# Altium project comp9.PrjPcb (part 2 of 2)

## Sheet ethusb.SchDoc
size A
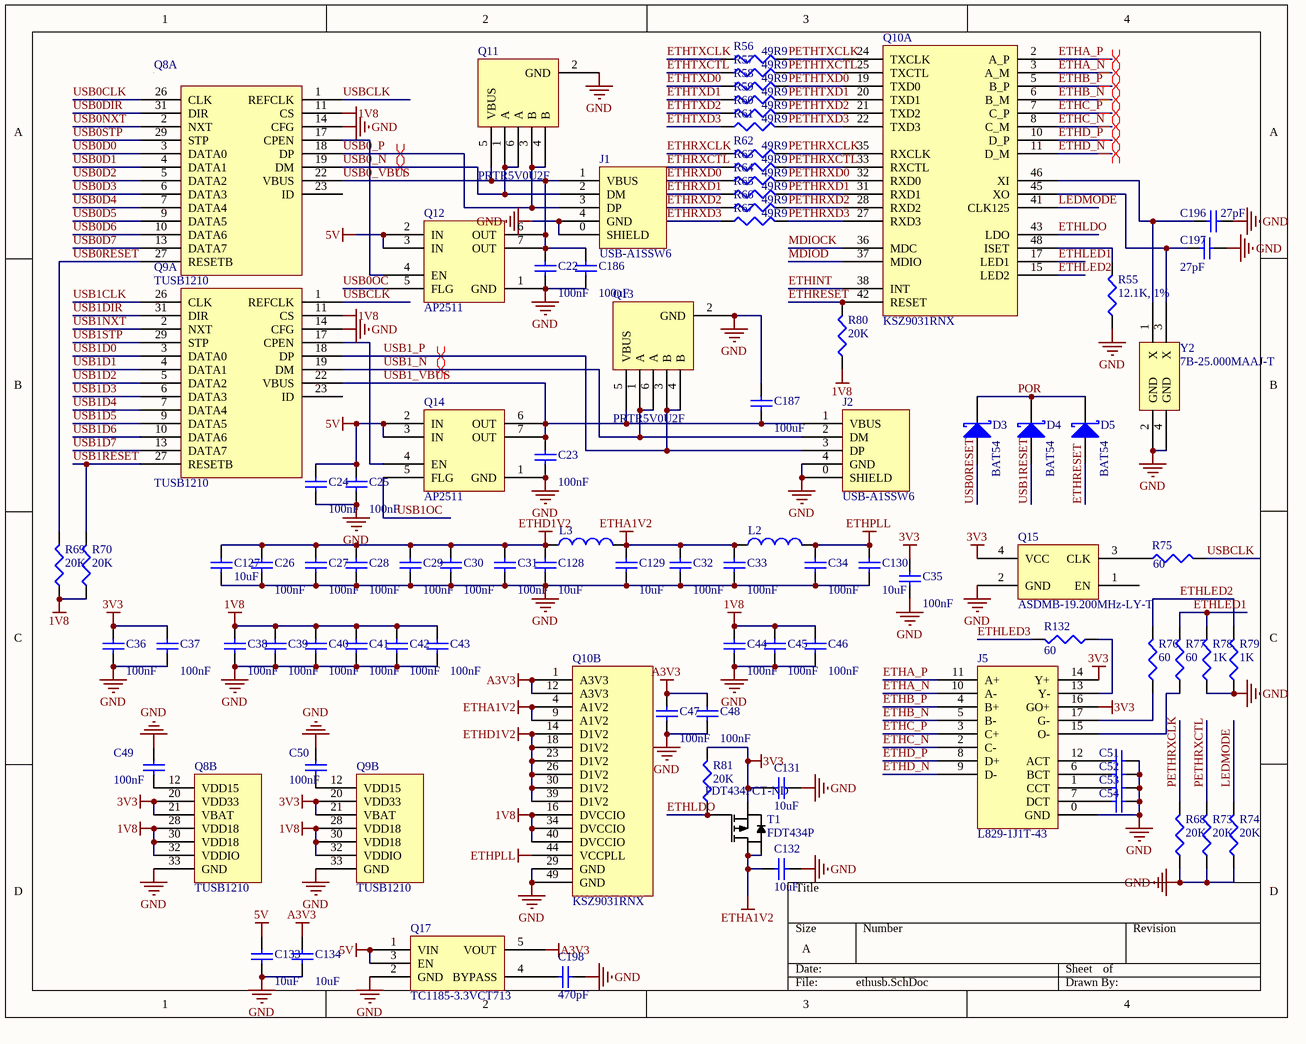
[diagram p4: ethusb.SchDoc]

### Parts
C22  value 100nF  [CAPC1005X06L]  (hidden comment: Cap)
C23  value 100nF  [CAPC1005X06L]  (hidden comment: Cap)
C24  value 100nF  [CAPC1005X06L]  (hidden comment: Cap)
C25  value 100nF  [CAPC1005X06L]  (hidden comment: Cap)
C26  value 100nF  [CAPC1005X06L]  (hidden comment: Cap)
C27  value 100nF  [CAPC1005X06L]  (hidden comment: Cap)
C28  value 100nF  [CAPC1005X06L]  (hidden comment: Cap)
C29  value 100nF  [CAPC1005X06L]  (hidden comment: Cap)
C30  value 100nF  [CAPC1005X06L]  (hidden comment: Cap)
C31  value 100nF  [CAPC1005X06L]  (hidden comment: Cap)
C32  value 100nF  [CAPC1005X06L]  (hidden comment: Cap)
C33  value 100nF  [CAPC1005X06L]  (hidden comment: Cap)
C34  value 100nF  [CAPC1005X06L]  (hidden comment: Cap)
C35  value 100nF  [CAPC1005X06L]  (hidden comment: Cap)
C36  value 100nF  [CAPC1005X06L]  (hidden comment: Cap)
C37  value 100nF  [CAPC1005X06L]  (hidden comment: Cap)
C38  value 100nF  [CAPC1005X06L]  (hidden comment: Cap)
C39  value 100nF  [CAPC1005X06L]  (hidden comment: Cap)
C40  value 100nF  [CAPC1005X06L]  (hidden comment: Cap)
C41  value 100nF  [CAPC1005X06L]  (hidden comment: Cap)
C42  value 100nF  [CAPC1005X06L]  (hidden comment: Cap)
C43  value 100nF  [CAPC1005X06L]  (hidden comment: Cap)
C44  value 100nF  [CAPC1005X06L]  (hidden comment: Cap)
C45  value 100nF  [CAPC1005X06L]  (hidden comment: Cap)
C46  value 100nF  [CAPC1005X06L]  (hidden comment: Cap)
C47  value 100nF  [CAPC1005X06L]  (hidden comment: Cap)
C48  value 100nF  [CAPC1005X06L]  (hidden comment: Cap)
C49  value 100nF  [CAPC1005X06L]  (hidden comment: Cap)
C50  value 100nF  [CAPC1005X06L]  (hidden comment: Cap)
C51  Cap  [CAPC1005X06L]  (value not drawn)
C52  Cap  [CAPC1005X06L]  (value not drawn)
C53  Cap  [CAPC1005X06L]  (value not drawn)
C54  Cap  [CAPC1005X06L]  (value not drawn)
C127  value 10uF  [CAPC1608X90N]  (hidden comment: GRM188R60G106ME47)
C128  value 10uF  [CAPC1608X90N]  (hidden comment: GRM188R60G106ME47)
C129  value 10uF  [CAPC1608X90N]  (hidden comment: GRM188R60G106ME47)
C130  value 10uF  [CAPC1608X90N]  (hidden comment: GRM188R60G106ME47)
C131  value 10uF  [CAPC1608X90N]  (hidden comment: GRM188R60G106ME47)
C132  value 10uF  [CAPC1608X90N]  (hidden comment: GRM188R60G106ME47)
C133  value 10uF  [CAPC1608X90N]  (hidden comment: GRM188R60G106ME47)
C134  value 10uF  [CAPC1608X90N]  (hidden comment: GRM188R60G106ME47)
C186  value 100uF  [CAPC3225X220N]  (hidden comment: GRM31CR60J107ME39L)
C187  value 100uF  [CAPC3225X220N]  (hidden comment: GRM31CR60J107ME39L)
C196  value 27pF  [CAPC1608X90N]  (hidden comment: CL10C270JB8NNNC)
C197  value 27pF  [CAPC1608X90N]  (hidden comment: CL10C270JB8NNNC)
C198  value 470pF  [CAPC1608X90N]  (hidden comment: CL10C471JB8NCNC)
D3  BAT54  [BAT54]
D4  BAT54  [BAT54]
D5  BAT54  [BAT54]
J1  USB-A1SSW6  [USB-A1SSW6]
J2  USB-A1SSW6  [USB-A1SSW6]
J5  L829-1J1T-43  [ETH-L829-1J1T-43]
L2  BLM18SG121TN1  [CAPC1608X90N]  (value not drawn)
L3  BLM18SG121TN1  [CAPC1608X90N]  (value not drawn)
Q8  TUSB1210  [QFN50P500X500X80_HS-33N]  (parts A,B of 2)
Q9  TUSB1210  [QFN50P500X500X80_HS-33N]  (parts A,B of 2)
Q10  KSZ9031RNX  (parts A,B of 2)
Q11  PRTR5V0U2F  [SOT886]
Q12  AP2511  [SOIC127P600X175-8AN]
Q13  PRTR5V0U2F  [SOT886]
Q14  AP2511  [SOIC127P600X175-8AN]
Q15  ASDMB-19.200MHz-LY-T  [ASDMB]
Q17  TC1185-3.3VCT713  [SOT23-5]
R55  value 12.1K, 1%  [J1-0603]  (hidden comment: RC1608F1212CS)
R56  value 49R9  [CAPC1005X06L]  (hidden comment: RC1005F49R9CS)
R57  value 49R9  [CAPC1005X06L]  (hidden comment: RC1005F49R9CS)
R58  value 49R9  [CAPC1005X06L]  (hidden comment: RC1005F49R9CS)
R59  value 49R9  [CAPC1005X06L]  (hidden comment: RC1005F49R9CS)
R60  value 49R9  [CAPC1005X06L]  (hidden comment: RC1005F49R9CS)
R61  value 49R9  [CAPC1005X06L]  (hidden comment: RC1005F49R9CS)
R62  value 49R9  [CAPC1005X06L]  (hidden comment: RC1005F49R9CS)
R63  value 49R9  [CAPC1005X06L]  (hidden comment: RC1005F49R9CS)
R64  value 49R9  [CAPC1005X06L]  (hidden comment: RC1005F49R9CS)
R65  value 49R9  [CAPC1005X06L]  (hidden comment: RC1005F49R9CS)
R66  value 49R9  [CAPC1005X06L]  (hidden comment: RC1005F49R9CS)
R67  value 49R9  [CAPC1005X06L]  (hidden comment: RC1005F49R9CS)
R68  value 20K  [J1-0603]  (hidden comment: RC1608F203CS)
R69  value 20K  [J1-0603]  (hidden comment: RC1608F203CS)
R70  value 20K  [J1-0603]  (hidden comment: RC1608F203CS)
R73  value 20K  [J1-0603]  (hidden comment: RC1608F203CS)
R74  value 20K  [J1-0603]  (hidden comment: RC1608F203CS)
R75  value 60  [J1-0603]  (hidden comment: RC1608F60R4CS)
R76  value 60  [J1-0603]  (hidden comment: RC1608F60R4CS)
R77  value 60  [J1-0603]  (hidden comment: RC1608F60R4CS)
R78  value 1K  [J1-0603]  (hidden comment: RC1608J102CS)
R79  value 1K  [J1-0603]  (hidden comment: RC1608J102CS)
R80  value 20K  [J1-0603]  (hidden comment: RC1608F203CS)
R81  value 20K  [J1-0603]  (hidden comment: RC1608F203CS)
R132  value 60  [J1-0603]  (hidden comment: RC1608F60R4CS)
T1  FDT434P  Supplier Part Number 1: FDT434PCT-ND
Y2  7B-25.000MAAJ-T  [XTAL]

### Nets
1V8: C38.2 C39.2 C40.2 C41.2 C42.2 C43.2 C44.2 C45.2 C46.2 Q8.11(CS) Q8.28(VDD18) Q8.30(VDD18) Q8.32(VDDIO) Q9.11(CS) Q9.28(VDD18) Q9.30(VDD18) Q9.32(VDDIO) Q10.16(DVCCIO) Q10.34(DVCCIO) Q10.40(DVCCIO) R69.1 R70.1 R80.1
3V3: C35.2 C36.2 C37.2 C131.2 J5.14(Y+) J5.16(GO+) Q8.20(VDD33) Q8.21(VBAT) Q9.20(VDD33) Q9.21(VBAT) Q15.4(VCC) R81.2 T1.3(S)
5V: C24.2 C25.2 C133.2 Q12.2(IN) Q12.3(IN) Q14.2(IN) Q14.3(IN) Q17.1(VIN) Q17.3(EN)
A3V3: C47.2 C48.2 C134.2 Q10.1(A3V3) Q10.12(A3V3) Q17.5(VOUT)
ETHA1V2: C32.2 C33.2 C129.2 C132.2 L2.1 L3.2 Q10.4(A1V2) Q10.9(A1V2) T1.2(D) T1.4(D)
ETHD1V2: C26.2 C27.2 C28.2 C29.2 C30.2 C31.2 C127.1 C128.2 L3.1 Q10.14(D1V2) Q10.18(D1V2) Q10.23(D1V2) Q10.26(D1V2) Q10.30(D1V2) Q10.39(D1V2)
ETHPLL: C34.2 C130.2 L2.2 Q10.44(VCCPLL)
GND: C22.1 C23.1 C24.1 C25.1 C26.1 C27.1 C28.1 C29.1 C30.1 C31.1 C32.1 C33.1 C34.1 C35.1 C36.1 C37.1 C38.1 C39.1 C40.1 C41.1 C42.1 C43.1 C44.1 C45.1 C46.1 C47.1 C48.1 C49.2 C50.1 C51.1 C52.1 C53.1 C54.1 C127.2 C128.1 C129.1 C130.1 C131.1 C132.1 C133.1 C134.1 C186.1 C187.2 C196.1 C197.1 C198.1 J1.0(SHIELD) J1.4(GND) J2.0(SHIELD) J2.4(GND) J5.0(GND) Q8.14(CFG) Q8.33(GND) Q9.14(CFG) Q9.33(GND) Q10.29(GND) Q10.49(GND) Q11.2(GND) Q12.1(GND) Q13.2(GND) Q14.1(GND) Q15.2(GND) Q17.2(GND) R55.1 R68.1 R73.1 R74.1 R78.1 R79.1 Y2.2(GND) Y2.4(GND)
ETHA_N: J5.10(A-) Q10.3(A_M)
ETHA_P: J5.11(A+) Q10.2(A_P)
ETHB_N: J5.5(B-) Q10.6(B_M)
ETHB_P: J5.4(B+) Q10.5(B_P)
ETHC_N: J5.2(C-) Q10.8(C_M)
ETHC_P: J5.3(C+) Q10.7(C_P)
ETHD_N: J5.9(D-) Q10.11(D_M)
ETHD_P: J5.8(D+) Q10.10(D_P)
ETHINT: Q10.38(INT)
ETHLDO: Q10.43(LDO) R81.1 T1.1(G)
ETHLED1: Q10.17(LED1) R77.2 R78.2
ETHLED2: Q10.15(LED2) R76.2 R79.2
ETHLED3: R132.2
ETHRESET: D5.1(A) Q10.42(RESET) R80.2
ETHRXCLK: R62.1
ETHRXCTL: R63.1
ETHRXD0: R64.1
ETHRXD1: R65.1
ETHRXD2: R66.1
ETHRXD3: R67.1
ETHTXCLK: R56.1
ETHTXCTL: R57.1
ETHTXD0: R58.1
ETHTXD1: R59.1
ETHTXD2: R60.1
ETHTXD3: R61.1
LEDMODE: Q10.41(CLK125) R74.2
MDIOCK: Q10.36(MDC)
MDIOD: Q10.37(MDIO)
PETHRXCLK: Q10.35(RXCLK) R62.2 R68.2
PETHRXCTL: Q10.33(RXCTL) R63.2 R73.2
PETHRXD0: Q10.32(RXD0) R64.2
PETHRXD1: Q10.31(RXD1) R65.2
PETHRXD2: Q10.28(RXD2) R66.2
PETHRXD3: Q10.27(RXD3) R67.2
PETHTXCLK: Q10.24(TXCLK) R56.2
PETHTXCTL: Q10.25(TXCTL) R57.2
PETHTXD0: Q10.19(TXD0) R58.2
PETHTXD1: Q10.20(TXD1) R59.2
PETHTXD2: Q10.21(TXD2) R60.2
PETHTXD3: Q10.22(TXD3) R61.2
POR: D3.2(K) D4.2(K) D5.2(K)
USB0_N: J1.2(DM) Q8.19(DM) Q11.1(A) Q11.6(A)
USB0_P: J1.3(DP) Q8.18(DP) Q11.3(B) Q11.4(B)
USB0_VBUS: C22.2 C186.2 J1.1(VBUS) Q8.22(VBUS) Q11.5(VBUS) Q12.6(OUT) Q12.7(OUT)
USB0CLK: Q8.26(CLK)
USB0D0: Q8.3(DATA0)
USB0D1: Q8.4(DATA1)
USB0D2: Q8.5(DATA2)
USB0D3: Q8.6(DATA3)
USB0D4: Q8.7(DATA4)
USB0D5: Q8.9(DATA5)
USB0D6: Q8.10(DATA6)
USB0D7: Q8.13(DATA7)
USB0DIR: Q8.31(DIR)
USB0NXT: Q8.2(NXT)
USB0OC: Q12.5(FLG)
USB0RESET: D3.1(A) Q8.27(RESETB) R69.2
USB0STP: Q8.29(STP)
USB1_N: J2.2(DM) Q9.19(DM) Q13.1(A) Q13.6(A)
USB1_P: J2.3(DP) Q9.18(DP) Q13.3(B) Q13.4(B)
USB1_VBUS: C23.2 C187.1 J2.1(VBUS) Q9.22(VBUS) Q13.5(VBUS) Q14.6(OUT) Q14.7(OUT)
USB1CLK: Q9.26(CLK)
USB1D0: Q9.3(DATA0)
USB1D1: Q9.4(DATA1)
USB1D2: Q9.5(DATA2)
USB1D3: Q9.6(DATA3)
USB1D4: Q9.7(DATA4)
USB1D5: Q9.9(DATA5)
USB1D6: Q9.10(DATA6)
USB1D7: Q9.13(DATA7)
USB1DIR: Q9.31(DIR)
USB1NXT: Q9.2(NXT)
USB1OC: Q14.5(FLG)
USB1RESET: D4.1(A) Q9.27(RESETB) R70.2
USB1STP: Q9.29(STP)
USBCLK: Q8.1(REFCLK) Q9.1(REFCLK) R75.2
NetC49_1: C49.1 Q8.12(VDD15)
NetC50_2: C50.2 Q9.12(VDD15)
NetC51_2: C51.2 J5.12(ACT)
NetC52_2: C52.2 J5.6(BCT)
NetC53_2: C53.2 J5.1(CCT)
NetC54_2: C54.2 J5.7(DCT)
NetC196_2: C196.2 Q10.46(XI) Y2.1(X)
NetC197_2: C197.2 Q10.45(XO) Y2.3(X)
NetC198_2: C198.2 Q17.4(BYPASS)
NetJ5_13: J5.13(Y-) R132.1
NetJ5_15: J5.15(O-) R77.1
NetJ5_17: J5.17(G-) R76.1
NetQ8_17: Q8.17(CPEN) Q12.4(EN)
NetQ9_17: Q9.17(CPEN) Q14.4(EN)
NetQ10_48: Q10.48(ISET) R55.2
NetQ15_3: Q15.3(CLK) R75.1

Not connected (* = marked no-connect by the designer): Q8 23(ID); Q9 23(ID); Q15 1(EN)

### Layout directives
differential pair: ETHA_N, ETHA_P, ETHB_N, ETHB_P, ETHC_N, ETHC_P, ETHD_N, ETHD_P, USB0_N, USB0_P, USB1_N, USB1_P

### Library data of the parts
C22-C50 C127-C134 C186 C187 C196-C198 = Cap: Capacitor; Published: 8-Jun-2000; LatestRevisionDate: 17-Jul-2002; LatestRevisionNote: Re-released for DXP Platform.; PackageReference: RAD-0.3; Publisher: Altium Limited; PackageDescription: Radial Cap, Thru-Hole; 2 Leads; 0.3 in Pin Spacing; Supplier 1: Digi-Key
  C22-C50: Supplier Part Number 1: 1276-1443-1-ND
  C127-C134: Supplier Part Number 1: 490-3298-1-ND
  C186 C187: Supplier Part Number 1: 490-4539-1-ND
  C196 C197: Supplier Part Number 1: 1276-1086-1-ND
  C198: Supplier Part Number 1: 1276-2302-1-ND
C51-C54 = Cap: Capacitor; Value: 100nF; Published: 8-Jun-2000; LatestRevisionDate: 17-Jul-2002; LatestRevisionNote: Re-released for DXP Platform.; PackageReference: RAD-0.3; Publisher: Altium Limited; PackageDescription: Radial Cap, Thru-Hole; 2 Leads; 0.3 in Pin Spacing; Supplier 1: Digi-Key; Supplier Part Number 1: 1276-1443-1-ND
D3-D5 = D Schottky: Schottky Diode; Published: 8-Jun-2000; LatestRevisionDate: 17-Jul-2002; LatestRevisionNote: Re-released for DXP Platform.; PackageReference: SMB; Publisher: Altium Limited; PackageDescription: DO-214-AA/SMB; 2 C-Bend Leads; Body 5.3 x 3.6 mm, inc. leads (LxW); Code_JEDEC: DO-214-AA; Supplier 1: Digi-Key; Supplier Part Number 1: BAT54FSCT-ND
J1 J2 = USB: Supplier 1: Digi-Key; Supplier Part Number 1: ED2991-ND
J5 = ETH: Supplier 1: Digi-Key; Supplier Part Number 1: 380-1110-ND
L2 L3 = Inductor: Code_IEC: 1005; Value: 10mH; Published: 8-Jun-2000; LatestRevisionDate: 29-May-2009; LatestRevisionNote: IPC-7351 Footprint Added.; PackageReference: 0402-A; Publisher: Altium Limited; PackageDescription: Chip Inductor; Code_JEITA: 0402; Supplier 1: Digi-Key; Supplier Part Number 1: 490-3996-1-ND
Q15 = osc: Supplier 1: Digi-Key; Supplier Part Number 1: 535-11184-1-ND
Q17 = LDO: Supplier 1: Digi-Key; Supplier Part Number 1: TC11853.3VCT713CT-ND
R55-R70 R73-R81 R132 = Res3: Resistor; Published: 8-Jun-2000; LatestRevisionDate: 29-May-2009; LatestRevisionNote: IPC-7351 Footprint Added.; PackageReference: J1-0603; PackageDescription: Chip Resistor; Supplier 1: Digi-Key
  R55: Publisher: Altium Limited; Supplier Part Number 1: 1276-4751-1-ND
  R56-R67: Publisher: Altium Limited; Supplier Part Number 1: 1276-3469-1-ND
  R68-R70 R73 R74: Publisher: Altium Limited; Supplier Part Number 1: 1276-4768-1-ND
  R75-R77 R132: Supplier Part Number 1: 1276-4547-1-ND
  R78 R79: Supplier Part Number 1: 1276-5062-1-ND
  R80 R81: Supplier Part Number 1: 1276-4768-1-ND
T1 = PMOS4: Supplier 1: Digi-Key
Y2 = XTAL: Supplier 1: Digi-Key; Supplier Part Number 1: 887-1112-1-ND
Q8 Q9 = TUSB1210: Supplier 1: Digi-Key; Supplier Part Number 1: 296-28384-1-ND
Q10 = KSZ9031RNX: Supplier 1: Digi-Key; Supplier Part Number 1: 576-4041-1-ND
Q11 Q13 = PRTR5V0U2F: Supplier 1: Digi-Key; Supplier Part Number 1: 568-4677-1-ND
Q12 Q14 = AP2511: Supplier 1: Digi-Key; Supplier Part Number 1: AP2511S-13DICT-ND

## Sheet gtp.SchDoc
size A
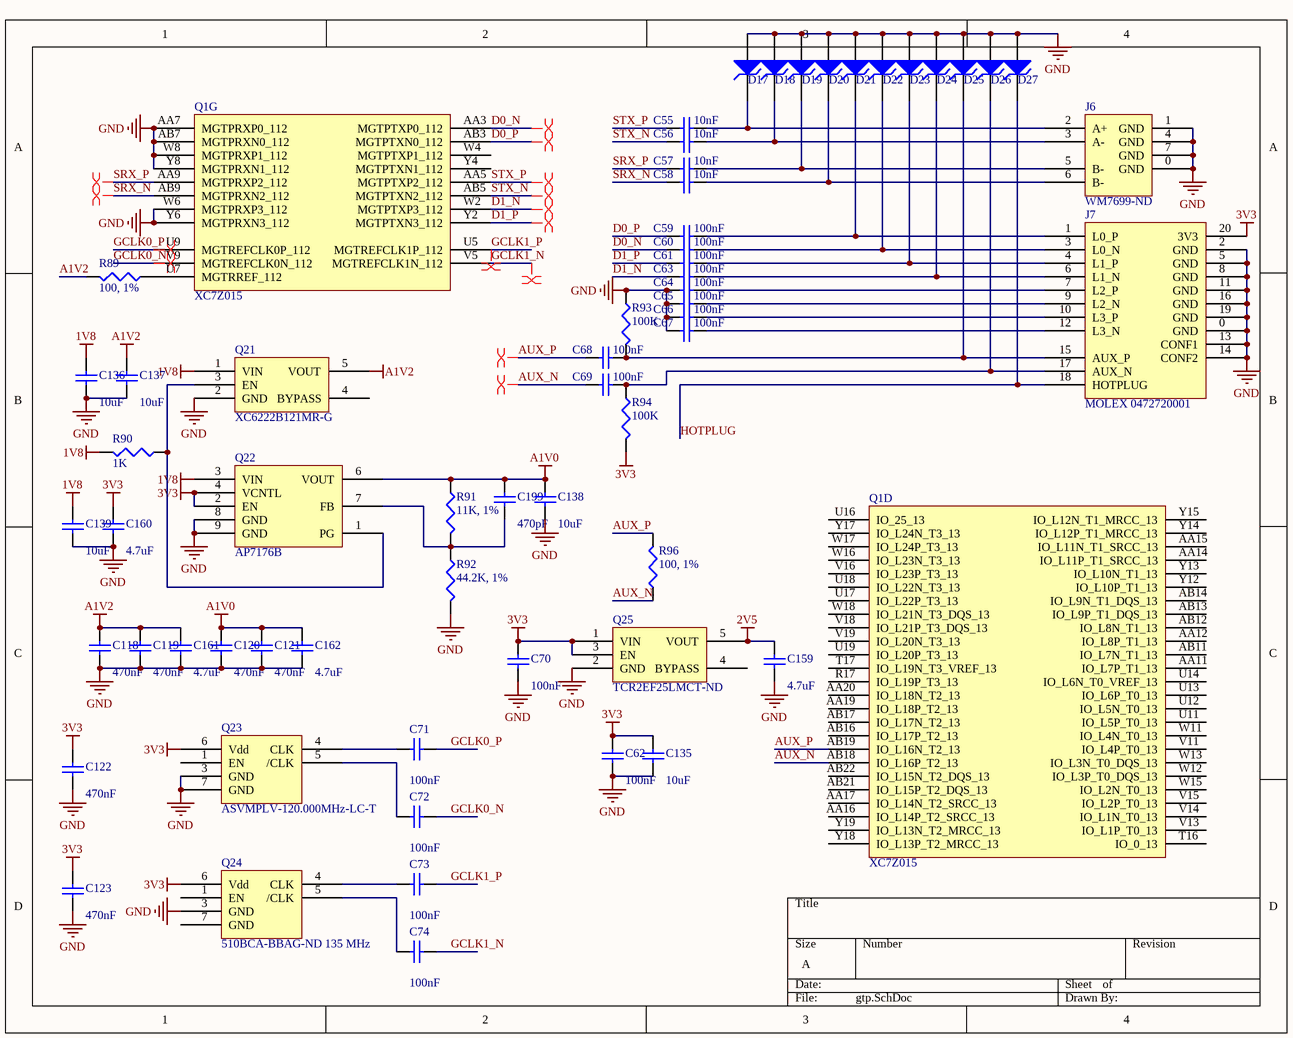
[diagram p5: gtp.SchDoc]

### Parts
C55  value 10nF  [CAPC1005X06L]  (hidden comment: Cap)
C56  value 10nF  [CAPC1005X06L]  (hidden comment: Cap)
C57  value 10nF  [CAPC1005X06L]  (hidden comment: Cap)
C58  value 10nF  [CAPC1005X06L]  (hidden comment: Cap)
C59  value 100nF  [CAPC1005X06L]  (hidden comment: Cap)
C60  value 100nF  [CAPC1005X06L]  (hidden comment: Cap)
C61  value 100nF  [CAPC1005X06L]  (hidden comment: Cap)
C62  value 100nF  [CAPC1005X06L]  (hidden comment: Cap)
C63  value 100nF  [CAPC1005X06L]  (hidden comment: Cap)
C64  value 100nF  [CAPC1005X06L]  (hidden comment: Cap)
C65  value 100nF  [CAPC1005X06L]  (hidden comment: Cap)
C66  value 100nF  [CAPC1005X06L]  (hidden comment: Cap)
C67  value 100nF  [CAPC1005X06L]  (hidden comment: Cap)
C68  value 100nF  [CAPC1005X06L]  (hidden comment: Cap)
C69  value 100nF  [CAPC1005X06L]  (hidden comment: Cap)
C70  value 100nF  [CAPC1005X06L]  (hidden comment: Cap)
C71  value 100nF  [CAPC1005X06L]  (hidden comment: Cap)
C72  value 100nF  [CAPC1005X06L]  (hidden comment: Cap)
C73  value 100nF  [CAPC1005X06L]  (hidden comment: Cap)
C74  value 100nF  [CAPC1005X06L]  (hidden comment: Cap)
C118  value 470nF  [CAPC1005X06L]  (hidden comment: JMK105BJ474KV-F)
C119  value 470nF  [CAPC1005X06L]  (hidden comment: JMK105BJ474KV-F)
C120  value 470nF  [CAPC1005X06L]  (hidden comment: JMK105BJ474KV-F)
C121  value 470nF  [CAPC1005X06L]  (hidden comment: JMK105BJ474KV-F)
C122  value 470nF  [CAPC1005X06L]  (hidden comment: JMK105BJ474KV-F)
C123  value 470nF  [CAPC1005X06L]  (hidden comment: JMK105BJ474KV-F)
C135  value 10uF  [CAPC1608X90N]  (hidden comment: GRM188R60G106ME47)
C136  value 10uF  [CAPC1608X90N]  (hidden comment: GRM188R60G106ME47)
C137  value 10uF  [CAPC1608X90N]  (hidden comment: GRM188R60G106ME47)
C138  value 10uF  [CAPC1608X90N]  (hidden comment: GRM188R60G106ME47)
C139  value 10uF  [CAPC1608X90N]  (hidden comment: GRM188R60G106ME47)
C159  value 4.7uF  [CAPC1608X90N]  (hidden comment: GRM188R60J475ME19D)
C160  value 4.7uF  [CAPC1608X90N]  (hidden comment: GRM188R60J475ME19D)
C161  value 4.7uF  [CAPC1608X90N]  (hidden comment: GRM188R60J475ME19D)
C162  value 4.7uF  [CAPC1608X90N]  (hidden comment: GRM188R60J475ME19D)
C199  value 470pF  [CAPC1608X90N]  (hidden comment: CL10C471JB8NCNC)
D17  EZAEG2A  [CAPC1005X55N]  (value not drawn)
D18  EZAEG2A  [CAPC1005X55N]  (value not drawn)
D19  EZAEG2A  [CAPC1005X55N]  (value not drawn)
D20  EZAEG2A  [CAPC1005X55N]  (value not drawn)
D21  EZAEG2A  [CAPC1005X55N]  (value not drawn)
D22  EZAEG2A  [CAPC1005X55N]  (value not drawn)
D23  EZAEG2A  [CAPC1005X55N]  (value not drawn)
D24  EZAEG2A  [CAPC1005X55N]  (value not drawn)
D25  EZAEG2A  [CAPC1005X55N]  (value not drawn)
D26  EZAEG2A  [CAPC1005X55N]  (value not drawn)
D27  EZAEG2A  [CAPC1005X55N]  (value not drawn)
J6  WM7699-ND  [WM7699-ND]
J7  MOLEX 0472720001  [MOLEX0472720001]
Q1  XC7Z015  [BGA484x22]  (parts D,G of 9)
Q21  XC6222B121MR-G  [SOT23-5]
Q22  AP7176B  [SOIC127P600X135_HS-9N]
Q23  ASVMPLV-120.000MHz-LC-T  [ASVMP]
Q24  510BCA-BBAG-ND 135 MHz  [Si510]
Q25  TCR2EF25LMCT-ND  [SOT23-5]
R89  value 100, 1%  [J1-0603]  (hidden comment: RC1608F101CS)
R90  value 1K  [J1-0603]  (hidden comment: RC1608J102CS)
R91  value 11K, 1%  [J1-0603]  (hidden comment: RC1608F113CS)
R92  value 44.2K, 1%  [J1-0603]  (hidden comment: RC1608F4422CS)
R93  value 100K  [J1-0603]  (hidden comment: RC1608F104CS)
R94  value 100K  [J1-0603]  (hidden comment: RC1608F104CS)
R96  value 100, 1%  [J1-0603]  (hidden comment: RC1608F101CS)

### Nets
1V8: C136.2 C139.2 Q21.1(VIN) Q22.3(VIN) R90.2
2V5: C159.1 Q25.5(VOUT)
3V3: C62.2 C70.2 C122.2 C123.2 C135.2 C160.1 J7.20(3V3) Q22.2(EN) Q22.4(VCNTL) Q23.6(Vdd) Q24.6(Vdd) Q25.1(VIN) Q25.3(EN) R94.2
A1V0: C120.2 C121.2 C138.2 C162.1 C199.1 Q22.6(VOUT) R91.1
A1V2: C118.2 C119.2 C137.2 C161.1 Q21.5(VOUT) R89.2
GND: C62.1 C64.2 C65.2 C66.2 C67.2 C70.1 C118.1 C119.1 C120.1 C121.1 C122.1 C123.1 C135.1 C136.1 C137.1 C138.1 C139.1 C159.2 C160.2 C161.2 C162.2 D17.1(A) D18.1(A) D19.1(A) D20.1(A) D21.1(A) D22.1(A) D23.1(A) D24.1(A) D25.1(A) D26.1(A) D27.1(A) J6.0(GND) J6.1(GND) J6.4(GND) J6.7(GND) J7.0(GND) J7.2(GND) J7.5(GND) J7.8(GND) J7.11(GND) J7.13(CONF1) J7.14(CONF2) J7.16(GND) J7.19(GND) Q1.AA7(MGTPRXP0_112) Q1.AB7(MGTPRXN0_112) Q1.W6(MGTPRXP3_112) Q1.W8(MGTPRXP1_112) Q1.Y6(MGTPRXN3_112) Q1.Y8(MGTPRXN1_112) Q21.2(GND) Q22.8(GND) Q22.9(GND) Q23.3(GND) Q23.7(GND) Q24.3(GND) Q25.2(GND) R92.2 R93.1
AUX_N: C69.2 Q1.AB18(IO_L16P_T2_13) R96.1
AUX_P: C68.2 Q1.AB19(IO_L16N_T2_13) R96.2
D0_N: C60.2 Q1.AA3(MGTPTXP0_112)
D0_P: C59.2 Q1.AB3(MGTPTXN0_112)
D1_N: C63.2 Q1.W2(MGTPTXP3_112)
D1_P: C61.2 Q1.Y2(MGTPTXN3_112)
GCLK0_N: C72.1 Q1.V9(MGTREFCLK0N_112)
GCLK0_P: C71.1 Q1.U9(MGTREFCLK0P_112)
GCLK1_N: C74.1 Q1.V5(MGTREFCLK1N_112)
GCLK1_P: C73.1 Q1.U5(MGTREFCLK1P_112)
HOTPLUG: D27.2(K) J7.18(HOTPLUG)
SRX_N: C58.2 Q1.AB9(MGTPRXN2_112)
SRX_P: C57.2 Q1.AA9(MGTPRXP2_112)
STX_N: C56.2 Q1.AB5(MGTPTXN2_112)
STX_P: C55.2 Q1.AA5(MGTPTXP2_112)
NetC55_1: C55.1 D17.2(K) J6.2(A+)
NetC56_1: C56.1 D18.2(K) J6.3(A-)
NetC57_1: C57.1 D19.2(K) J6.5(B-)
NetC58_1: C58.1 D20.2(K) J6.6(B-)
NetC59_1: C59.1 D21.2(K) J7.1(L0_P)
NetC60_1: C60.1 D22.2(K) J7.3(L0_N)
NetC61_1: C61.1 D23.2(K) J7.4(L1_P)
NetC63_1: C63.1 D24.2(K) J7.6(L1_N)
NetC64_1: C64.1 J7.7(L2_P)
NetC65_1: C65.1 J7.9(L2_N)
NetC66_1: C66.1 J7.10(L3_P)
NetC67_1: C67.1 J7.12(L3_N)
NetC68_1: C68.1 D25.2(K) J7.15(AUX_P) R93.2
NetC69_1: C69.1 D26.2(K) J7.17(AUX_N) R94.1
NetC71_2: C71.2 Q23.4(CLK)
NetC72_2: C72.2 Q23.5(/CLK)
NetC73_2: C73.2 Q24.4(CLK)
NetC74_2: C74.2 Q24.5(/CLK)
NetC199_2: C199.2 Q22.7(FB) R91.2 R92.1
NetQ1_U7: Q1.U7(MGTRREF_112) R89.1
NetQ21_3: Q21.3(EN) Q22.1(PG) R90.1

Not connected (* = marked no-connect by the designer): Q1 AA11(IO_L7P_T1_13) AA12(IO_L8P_T1_13) AA14(IO_L11P_T1_SRCC_13) AA15(IO_L11N_T1_SRCC_13) AA16(IO_L14P_T2_SRCC_13) AA17(IO_L14N_T2_SRCC_13) AA19(IO_L18P_T2_13) AA20(IO_L18N_T2_13) AB11(IO_L7N_T1_13) AB12(IO_L8N_T1_13) AB13(IO_L9P_T1_DQS_13) AB14(IO_L9N_T1_DQS_13) AB16(IO_L17P_T2_13) AB17(IO_L17N_T2_13) AB21(IO_L15P_T2_DQS_13) AB22(IO_L15N_T2_DQS_13) R17(IO_L19P_T3_13) T16(IO_0_13) T17(IO_L19N_T3_VREF_13) U11(IO_L5P_T0_13) U12(IO_L5N_T0_13) U13(IO_L6P_T0_13) U14(IO_L6N_T0_VREF_13) U16(IO_25_13) U17(IO_L22P_T3_13) U18(IO_L22N_T3_13) U19(IO_L20P_T3_13) V11(IO_L4P_T0_13) V13(IO_L1P_T0_13) V14(IO_L1N_T0_13) V15(IO_L2P_T0_13) V16(IO_L23P_T3_13) V18(IO_L21P_T3_DQS_13) V19(IO_L20N_T3_13) W4(MGTPTXP1_112) W11(IO_L4N_T0_13) W12(IO_L3P_T0_DQS_13) W13(IO_L3N_T0_DQS_13) W15(IO_L2N_T0_13) W16(IO_L23N_T3_13) W17(IO_L24P_T3_13) W18(IO_L21N_T3_DQS_13) Y4(MGTPTXN1_112) Y12(IO_L10P_T1_13) Y13(IO_L10N_T1_13) Y14(IO_L12P_T1_MRCC_13) Y15(IO_L12N_T1_MRCC_13) Y17(IO_L24N_T3_13) Y18(IO_L13P_T2_MRCC_13) Y19(IO_L13N_T2_MRCC_13); Q21 4(BYPASS); Q23 1(EN); Q24 1(EN) 7(GND); Q25 4(BYPASS)

### Layout directives
differential pair: AUX_N, AUX_P, D0_N, D0_P, D1_N, D1_P, GCLK0_N, GCLK0_P, GCLK1_N, GCLK1_P, SRX_N, SRX_P, STX_N, STX_P

### Library data of the parts
C55-C74 C118-C123 C135-C139 C159-C162 C199 = Cap: Capacitor; Published: 8-Jun-2000; LatestRevisionDate: 17-Jul-2002; LatestRevisionNote: Re-released for DXP Platform.; PackageReference: RAD-0.3; Publisher: Altium Limited; PackageDescription: Radial Cap, Thru-Hole; 2 Leads; 0.3 in Pin Spacing; Supplier 1: Digi-Key
  C55-C58: Supplier Part Number 1: 490-4516-1-ND
  C59-C74: Supplier Part Number 1: 1276-1443-1-ND
  C118-C123: Supplier Part Number 1: 587-1230-1-ND
  C135-C139: Supplier Part Number 1: 490-3298-1-ND
  C159-C162: Supplier Part Number 1: 490-5421-1-ND
  C199: Supplier Part Number 1: 1276-2302-1-ND
D17-D27 = D Zener: Zener Diode; Published: 8-Jun-2000; LatestRevisionDate: 17-Jul-2002; LatestRevisionNote: Re-released for DXP Platform.; PackageReference: DIODE-0.7; Publisher: Altium Limited; PackageDescription: Diode, Thru-Hole; 2 Leads; 0.7 in Pin Spacing; Supplier 1: Digi-Key; Supplier Part Number 1: P13571CT-ND
J7 = DP: Supplier 1: Digi-Key; Supplier Part Number 1: WM19271CT-ND
Q21 Q25 = LDO: Supplier 1: Digi-Key
  Q21: Supplier Part Number 1: 893-1139-1-ND
  Q25: Supplier Part Number 1: TCR2EF25LM(CTCT-ND
Q23 Q24 = ASVMP: Supplier 1: Digi-Key
  Q23: Supplier Part Number 1: 535-12186-1-ND
  Q24: Supplier Part Number 1: 510BCA-BBAG-ND
R89-R94 R96 = Res3: Resistor; Published: 8-Jun-2000; LatestRevisionDate: 29-May-2009; LatestRevisionNote: IPC-7351 Footprint Added.; PackageReference: J1-0603; Publisher: Altium Limited; PackageDescription: Chip Resistor; Supplier 1: Digi-Key
  R89 R96: Supplier Part Number 1: 1276-3482-1-ND
  R90: Supplier Part Number 1: 1276-5062-1-ND
  R91: Supplier Part Number 1: 1276-4746-1-ND
  R92: Supplier Part Number 1: 1276-4805-1-ND
  R93 R94: Supplier Part Number 1: 1276-3486-1-ND
J6 = WM7699-ND: Supplier 1: Digi-Key; Supplier Part Number 1: WM7699-ND
Q1 = XC7Z015: Supplier 1: Digi-Key; Supplier Part Number 1: 122-1905-ND
Q22 = AP7176B: Supplier 1: Digi-Key; Supplier Part Number 1: AP7176BSP-13DICT-ND

## Sheet psu.SchDoc
size A
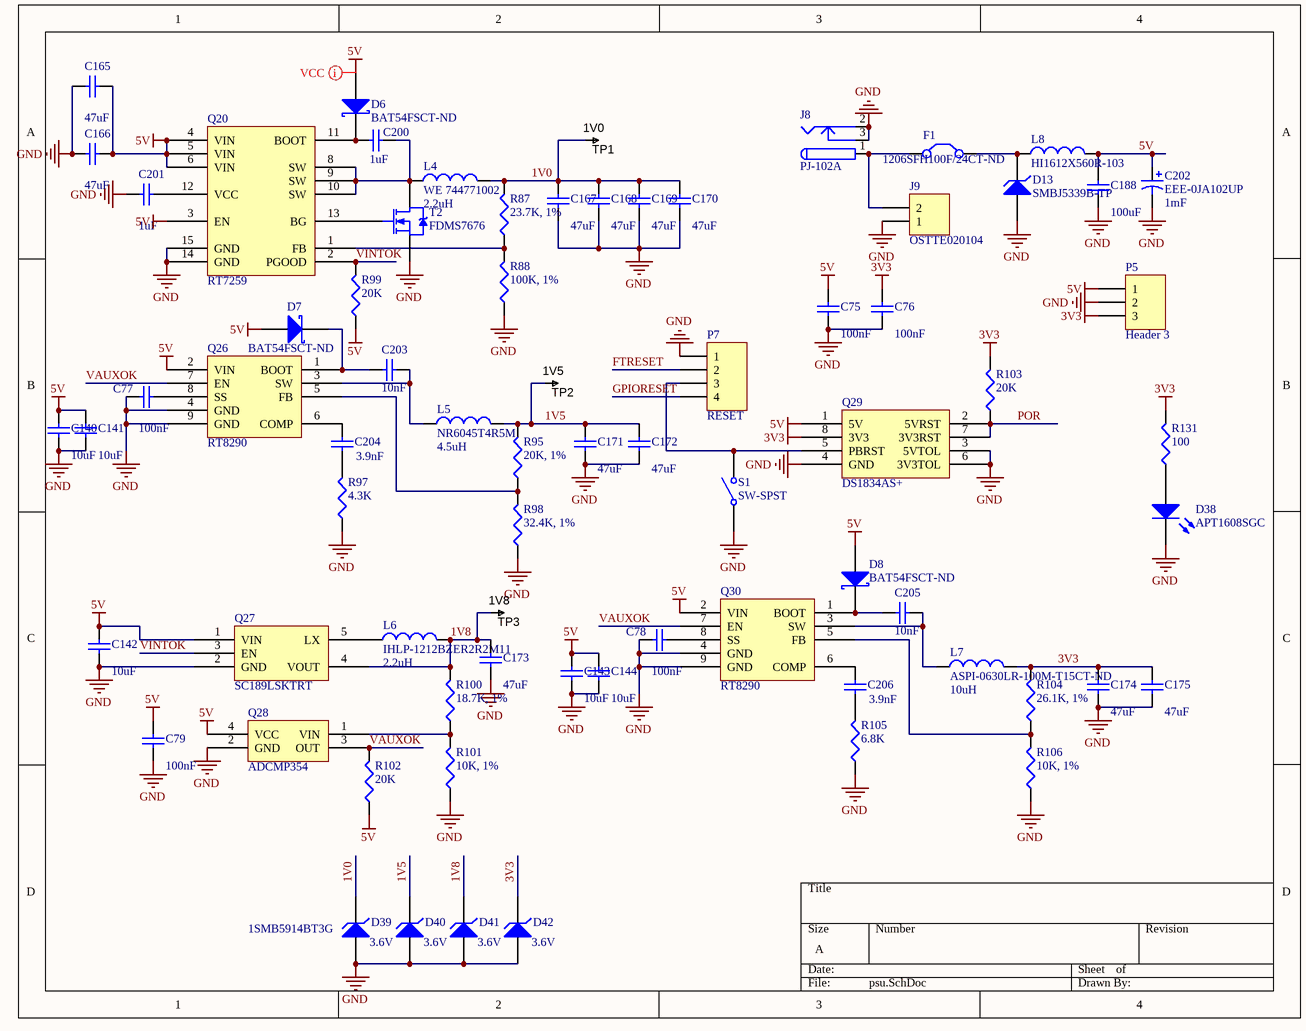
[diagram p6: psu.SchDoc]

### Parts
C75  value 100nF  [CAPC1005X06L]  (hidden comment: Cap)
C76  value 100nF  [CAPC1005X06L]  (hidden comment: Cap)
C77  value 100nF  [CAPC1005X06L]  (hidden comment: Cap)
C78  value 100nF  [CAPC1005X06L]  (hidden comment: Cap)
C79  value 100nF  [CAPC1005X06L]  (hidden comment: Cap)
C140  value 10uF  [CAPC1608X90N]  (hidden comment: GRM188R60G106ME47)
C141  value 10uF  [CAPC1608X90N]  (hidden comment: GRM188R60G106ME47)
C142  value 10uF  [CAPC1608X90N]  (hidden comment: GRM188R60G106ME47)
C143  value 10uF  [CAPC1608X90N]  (hidden comment: GRM188R60G106ME47)
C144  value 10uF  [CAPC1608X90N]  (hidden comment: GRM188R60G106ME47)
C165  value 47uF  [CAPC3225X220N]  (hidden comment: GRM31CR60J476ME19L)
C166  value 47uF  [CAPC3225X220N]  (hidden comment: GRM31CR60J476ME19L)
C167  value 47uF  [CAPC3225X220N]  (hidden comment: GRM31CR60J476ME19L)
C168  value 47uF  [CAPC3225X220N]  (hidden comment: GRM31CR60J476ME19L)
C169  value 47uF  [CAPC3225X220N]  (hidden comment: GRM31CR60J476ME19L)
C170  value 47uF  [CAPC3225X220N]  (hidden comment: GRM31CR60J476ME19L)
C171  value 47uF  [CAPC3225X220N]  (hidden comment: GRM31CR60J476ME19L)
C172  value 47uF  [CAPC3225X220N]  (hidden comment: GRM31CR60J476ME19L)
C173  value 47uF  [CAPC3225X220N]  (hidden comment: GRM31CR60J476ME19L)
C174  value 47uF  [CAPC3225X220N]  (hidden comment: GRM31CR60J476ME19L)
C175  value 47uF  [CAPC3225X220N]  (hidden comment: GRM31CR60J476ME19L)
C188  value 100uF  [CAPC3225X220N]  (hidden comment: GRM31CR60J107ME39L)
C200  value 1uF  [CAPC1608X90N]  (hidden comment: GRM188R60J105KA01D)
C201  value 1uF  [CAPC1608X90N]  (hidden comment: GRM188R60J105KA01D)
C202  EEE-0JA102UP  value 1mF  [CAP_ELEC_SIZE_E]
C203  value 10nF  [CAPC1005X06L]  (hidden comment: GRM188R71H103KA01D)
C204  value 3.9nF  [CAPC1608X90N]  (hidden comment: CL10B393KO8NNNC)
C205  value 10nF  [CAPC1005X06L]  (hidden comment: GRM188R71H103KA01D)
C206  value 3.9nF  [CAPC1608X90N]  (hidden comment: CL10B393KO8NNNC)
D6  BAT54FSCT-ND  [BAT54]
D7  BAT54FSCT-ND  [BAT54]
D8  BAT54FSCT-ND  [BAT54]
D13  SMBJ5339B-TP  [DO-214AA]
D38  APT1608SGC  [LED-0603]
D39  1SMB5914BT3G  value 3.6V  [DO-214AA]
D40  value 3.6V  [DO-214AA]  (hidden comment: 1SMB5914BT3G)
D41  value 3.6V  [DO-214AA]  (hidden comment: 1SMB5914BT3G)
D42  value 3.6V  [DO-214AA]  (hidden comment: 1SMB5914BT3G)
F1  1206SFH100F/24CT-ND  [CAPC3225X220N]
J8  PJ-102A  [PJ-102A]
J9  OSTTE020104  [OSTTEE02014]
L4  WE 744771002  value 2.2uH  [WE 744771002]
L5  NR6045T4R5M  value 4.5uH  [NR6045]
L6  IHLP-1212BZER2R2M11  value 2.2uH  [IHLP-1212BZ]
L7  ASPI-0630LR-100M-T15CT-ND  value 10uH  [ASPI-0630LR]
L8  HI1612X560R-103  [IND1612]
P5  Header 3  [HDR1X3]
P7  RESET  [HDR1X4]
Q20  RT7259  [WFDN-14L 4x3]
Q26  RT8290  [SOIC127P600X135_HS-9N]
Q27  SC189LSKTRT  [SOT23-5]
Q28  ADCMP354  [SC70-4]
Q29  DS1834AS+  [SOIC127P600X175-8AN]
Q30  RT8290  [SOIC127P600X135_HS-9N]
R87  value 23.7K, 1%  [J1-0603]  (hidden comment: RC1608F2372CS)
R88  value 100K, 1%  [J1-0603]  (hidden comment: RC1608F104CS)
R95  value 20K, 1%  [J1-0603]  (hidden comment: RC1608F203CS)
R97  value 4.3K  [J1-0603]  (hidden comment: RC1608F432CS)
R98  value 32.4K, 1%  [J1-0603]  (hidden comment: RC1608F3242CS)
R99  value 20K  [J1-0603]  (hidden comment: RC1608F203CS)
R100  value 18.7K, 1%  [J1-0603]  (hidden comment: RC1608F1872CS)
R101  value 10K, 1%  [J1-0603]  (hidden comment: RC1608F103CS)
R102  value 20K  [J1-0603]  (hidden comment: RC1608F203CS)
R103  value 20K  [J1-0603]  (hidden comment: RC1608F203CS)
R104  value 26.1K, 1%  [J1-0603]  (hidden comment: RC1608F2612CS)
R105  value 6.8K  [J1-0603]  (hidden comment: RC1608F682CS)
R106  value 10K, 1%  [J1-0603]  (hidden comment: RC1608F103CS)
R131  value 100  [J1-0603]  (hidden comment: RC1608F101CS)
S1  SW-SPST  [FSM4JSMA]
T2  FDMS7676  [PowerSO8]
TP1  1V0  [TP-R60]  (no BOM)
TP2  1V5  [TP-R60]  (no BOM)
TP3  1V8  [TP-R60]  (no BOM)

### Nets
1V0: C167.2 C168.2 C169.2 C170.2 D39.K L4.2 R87.2 TP1.1
1V5: C171.2 C172.2 D40.K L5.2 R95.2 TP2.1
1V8: C173.2 D41.K L6.2 Q27.4(VOUT) R100.2 TP3.1
3V3: C76.2 C174.2 C175.2 D42.K L7.2 P5.3 Q29.8(3V3) R103.2 R104.2 R131.2
5V: C75.2 C79.2 C140.2 C141.2 C142.2 C143.2 C144.2 C165.2 C166.2 C188.2 C202.1 D6.1(A) D7.1(A) D8.1(A) L8.2 P5.1 Q20.3(EN) Q20.4(VIN) Q20.5(VIN) Q20.6(VIN) Q26.2(VIN) Q27.1(VIN) Q28.4(VCC) Q29.1(5V) Q30.2(VIN) R99.1 R102.1
GND: C75.1 C76.1 C77.1 C78.1 C79.1 C140.1 C141.1 C142.1 C143.1 C144.1 C165.1 C166.1 C167.1 C168.1 C169.1 C170.1 C171.1 C172.1 C173.1 C174.1 C175.1 C188.1 C201.2 C202.2 D13.A D38.K D39.A D40.A D41.A D42.A J8.2 J8.3 J9.1 P5.2 P7.1 Q20.14(GND) Q20.15(GND) Q26.4(GND) Q26.9(GND) Q27.2(GND) Q28.2(GND) Q29.3(5VTOL) Q29.4(GND) Q29.6(3V3TOL) Q30.4(GND) Q30.9(GND) R88.1 R97.1 R98.1 R101.1 R105.1 R106.1 S1.4(COMMON) T2.3(S)
FTRESET: P7.2
GPIORESET: P7.4
POR: Q29.2(5VRST) Q29.7(3V3RST) R103.1
VAUXOK: Q26.7(EN) Q28.3(OUT) Q30.7(EN) R102.2
VINTOK: Q20.2(PGOOD) Q27.3(EN) R99.2
NetC77_2: C77.2 Q26.8(SS)
NetC78_2: C78.2 Q30.8(SS)
NetC200_1: C200.1 L4.1 Q20.8(SW) Q20.9(SW) Q20.10(SW) T2.2(D)
NetC200_2: C200.2 D6.2(K) Q20.11(BOOT)
NetC201_1: C201.1 Q20.12(VCC)
NetC203_1: C203.1 L5.1 Q26.3(SW)
NetC203_2: C203.2 D7.2(K) Q26.1(BOOT)
NetC204_1: C204.1 R97.2
NetC204_2: C204.2 Q26.6(COMP)
NetC205_1: C205.1 L7.1 Q30.3(SW)
NetC205_2: C205.2 D8.2(K) Q30.1(BOOT)
NetC206_1: C206.1 R105.2
NetC206_2: C206.2 Q30.6(COMP)
NetD13_K: D13.K F1.2(C2) L8.1
NetD38_A: D38.A R131.1
NetF1_1: F1.1(C1) J8.1 J9.2
NetL6_1: L6.1 Q27.5(LX)
NetP7_3: P7.3 Q29.5(PBRST) S1.2(NO)
NetQ20_1: Q20.1(FB) R87.1 R88.2
NetQ20_13: Q20.13(BG) T2.1(G)
NetQ26_5: Q26.5(FB) R95.1 R98.2
NetQ28_1: Q28.1(VIN) R100.1 R101.2
NetQ30_5: Q30.5(FB) R104.1 R106.2

### Layout directives
net class VCC: 5V

### Library data of the parts
C75-C79 C140-C144 C165-C175 C188 C200 C201 C203-C206 = Cap: Capacitor; Published: 8-Jun-2000; LatestRevisionDate: 17-Jul-2002; LatestRevisionNote: Re-released for DXP Platform.; PackageReference: RAD-0.3; Publisher: Altium Limited; PackageDescription: Radial Cap, Thru-Hole; 2 Leads; 0.3 in Pin Spacing; Supplier 1: Digi-Key
  C75-C79: Supplier Part Number 1: 1276-1443-1-ND
  C140-C144: Supplier Part Number 1: 490-3298-1-ND
  C165-C175: Supplier Part Number 1: 490-3907-1-ND
  C188: Supplier Part Number 1: 490-4539-1-ND
  C200 C201: Supplier Part Number 1: 490-1550-1-ND
  C203 C205: Supplier Part Number 1: 490-4516-1-ND
  C204 C206: Supplier Part Number 1: 1276-2057-1-ND
C202 = Cap Pol1: Polarized Capacitor (Radial); Published: 8-Jun-2000; LatestRevisionDate: 17-Jul-2002; LatestRevisionNote: Re-released for DXP Platform.; PackageReference: RB7.6-15; Publisher: Altium Limited; PackageDescription: Polarized Capacitor (Radial); 2 Leads; Supplier 1: Digi-Key; Supplier Part Number 1: PCE3855CT-ND
D6-D8 = D Schottky: Schottky Diode; Published: 8-Jun-2000; LatestRevisionDate: 17-Jul-2002; LatestRevisionNote: Re-released for DXP Platform.; PackageReference: SMB; Publisher: Altium Limited; PackageDescription: DO-214-AA/SMB; 2 C-Bend Leads; Body 5.3 x 3.6 mm, inc. leads (LxW); Code_JEDEC: DO-214-AA; Supplier 1: Digi-Key; Supplier Part Number 1: BAT54FSCT-ND
D13 D39-D42 = D Zener: Zener Diode; Published: 8-Jun-2000; LatestRevisionDate: 17-Jul-2002; LatestRevisionNote: Re-released for DXP Platform.; PackageReference: DIODE-0.7; Publisher: Altium Limited; PackageDescription: Diode, Thru-Hole; 2 Leads; 0.7 in Pin Spacing; Supplier 1: Digi-Key
  D13: Supplier Part Number 1: SMBJ5339B-TPMSCT-ND
  D39-D42: Supplier Part Number 1: 1SMB5914BT3GOSCT-ND
D38 = LED2: Typical RED, GREEN, YELLOW, AMBER GaAs LED; Published: 8-Jun-2000; LatestRevisionDate: 17-Jul-2002; LatestRevisionNote: Re-released for DXP Platform.; PackageVersion: Feb-2002; PackageReference: 3.2X1.6X1.1; Publisher: Altium Limited; PackageDescription: SM LED; 2 Flat Leads; Supplier 1: Digi-Key; Supplier Part Number 1: 754-1121-1-ND
F1 = Jumper: 10A Fuse; Published: 24-Mar-1999; LatestRevisionDate: 17-Jul-2002; LatestRevisionNote: Re-released for DXP Platform.; PackageReference: RAD-0.2; Publisher: Altium Limited; PackageDescription: Radial Cap, Thru-Hole; 2 Leads; 0.2 in Pin Spacing; Supplier 1: Digi-Key; Supplier Part Number 1: 1206SFH100F/24CT-ND
J8 = PWR2.5: Low Voltage Power Supply Connector; Published: 17-Dec-2003; DatasheetDocument: 09-May-2002; Publisher: Altium Limited; ComponentLink1Description: Manufacturer Link; ComponentLink1URL: http://domino.kycon.com/internet/Products.html; Supplier 1: Digi-Key; Supplier Part Number 1: CP-102A-ND
J9 = Header 2: Header, 2-Pin; LatestRevisionDate: 17-Jul-2002; LatestRevisionNote: Re-released for DXP Platform.; Publisher: Altium Limited; Supplier 1: Digi-Key; Supplier Part Number 1: ED2740-ND
L4-L7 = Inductor: Code_IEC: 1005; Published: 8-Jun-2000; LatestRevisionDate: 29-May-2009; LatestRevisionNote: IPC-7351 Footprint Added.; PackageReference: 0402-A; Publisher: Altium Limited; PackageDescription: Chip Inductor; Code_JEITA: 0402; Supplier 1: Digi-Key
  L4: Supplier Part Number 1: 732-1204-1-ND
  L5: Supplier Part Number 1: 587-2079-1-ND
  L6: Supplier Part Number 1: 541-1322-1-ND
  L7: Supplier Part Number 1: ASPI-0630LR-100M-T15CT-ND
L8 = Inductor: Code_IEC: 1005; Value: 10mH; Published: 8-Jun-2000; LatestRevisionDate: 29-May-2009; LatestRevisionNote: IPC-7351 Footprint Added.; PackageReference: 0402-A; Publisher: Altium Limited; PackageDescription: Chip Inductor; Code_JEITA: 0402; Supplier 1: Digi-Key; Supplier Part Number 1: 240-2499-1-ND
P5 = Header 3: Header, 3-Pin; LatestRevisionDate: 17-Jul-2002; LatestRevisionNote: Re-released for DXP Platform.; Publisher: Altium Limited
P7 = Header 4: Header, 4-Pin; LatestRevisionDate: 17-Jul-2002; LatestRevisionNote: Re-released for DXP Platform.; Publisher: Altium Limited
Q27 = SC189: Supplier 1: Digi-Key; Supplier Part Number 1: SC189LSKCT-ND
Q29 = DS1834: Supplier 1: Digi-Key; Supplier Part Number 1: DS1834AS+-ND
R87 R88 R95 R97-R106 R131 = Res3: Resistor; Published: 8-Jun-2000; LatestRevisionDate: 29-May-2009; LatestRevisionNote: IPC-7351 Footprint Added.; PackageReference: J1-0603; PackageDescription: Chip Resistor; Supplier 1: Digi-Key
  R87: Publisher: Altium Limited; Supplier Part Number 1: 1276-4776-1-ND
  R88: Publisher: Altium Limited; Supplier Part Number 1: 1276-3486-1-ND
  R95 R99 R102 R103: Publisher: Altium Limited; Supplier Part Number 1: 1276-4768-1-ND
  R97: Publisher: Altium Limited; Supplier Part Number 1: 1276-4706-1-ND
  R98: Publisher: Altium Limited; Supplier Part Number 1: 1276-3500-1-ND
  R100: Publisher: Altium Limited; Supplier Part Number 1: 1276-3494-1-ND
  R101 R106: Publisher: Altium Limited; Supplier Part Number 1: 1276-3485-1-ND
  R104: Publisher: Altium Limited; Supplier Part Number 1: 1276-4779-1-ND
  R105: Publisher: Altium Limited; Supplier Part Number 1: 1276-4728-1-ND
  R131: Supplier Part Number 1: 1276-3482-1-ND
S1 = SW-SPST: Single-Pole, Single-Throw Switch; Published: 24-Mar-1999; LatestRevisionDate: 17-Jul-2002; LatestRevisionNote: Re-released for DXP Platform.; PackageReference: SPST-2; Publisher: Altium Limited; PackageDescription: Switch; 2 Leads; Supplier 1: Digi-Key; Supplier Part Number 1: 450-1129-ND
T2 = NMOS-2: N-Channel Power MOSFET; Note: Pin 2 is electrically connected to pin 4.; Published: 8-Jun-2000; LatestRevisionDate: 17-Jul-2002; LatestRevisionNote: Re-released for DXP Platform.; DatasheetVersion: PD-9.814; PackageVersion: Feb-1997; PackageReference: TO-220AB; Publisher: Altium Limited; PackageDescription: TO, Thru-Hole, Vertical, Heatsink Mounted; 3 In-Line Leads; Pitch 2.54 mm; ComponentLink1Description: Manufacturer Link; ComponentLink1URL: http://www.irf.com/; Supplier 1: Digi-Key; Supplier Part Number 1: FDMS7676CT-ND
TP1-TP3 = TESTPOINT: SMD test pin
Q20 = RT7259: Supplier 1: Digi-Key; Supplier Part Number 1: 1028-1199-1-ND
Q26 Q30 = RT8290: Supplier 1: Digi-Key; Supplier Part Number 1: 1028-1047-1-ND
Q28 = ADCMP354: Supplier 1: Digi-Key; Supplier Part Number 1: ADCMP354YKSZ-REEL7CT-ND

## Sheet audio.SchDoc
size A
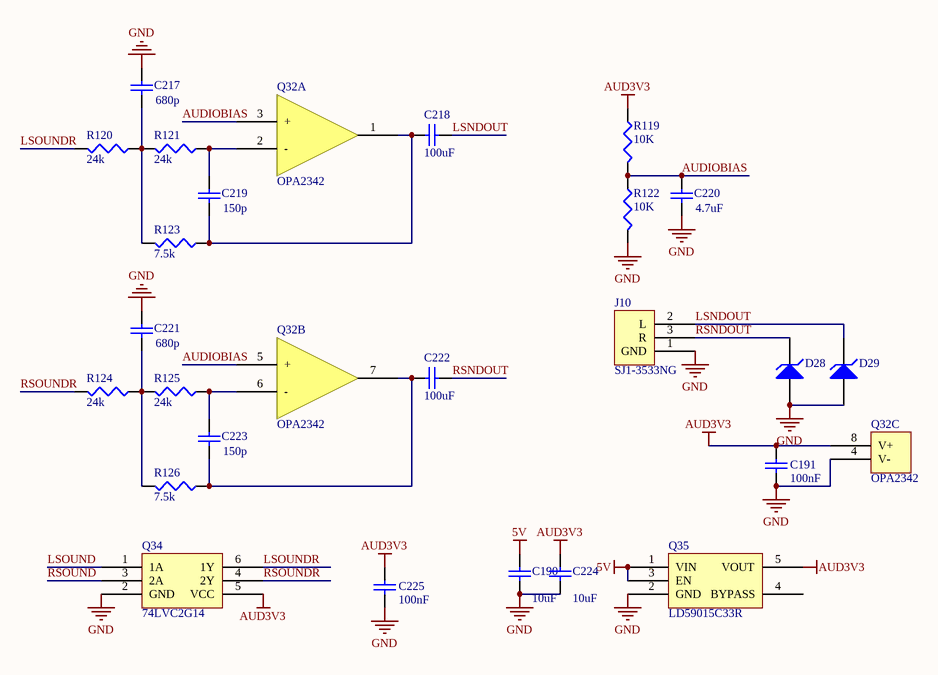
[diagram p7: audio.SchDoc]

### Parts
C190  value 10uF  [CAPC1608X90N]  (hidden comment: GRM188R60G106ME47)
C191  value 100nF  [CAPC1005X06L]  (hidden comment: Cap)
C217  value 680p  [CAPC1608X90N]
C218  value 100uF  [CAPC3225X220N]  (hidden comment: GRM31CR60J107ME39L)
C219  value 150p  [CAPC1608X90N]
C220  value 4.7uF  [CAPC1608X90N]  (hidden comment: GRM188R60J475ME19D)
C221  value 680p  [CAPC1608X90N]
C222  value 100uF  [CAPC3225X220N]  (hidden comment: GRM31CR60J107ME39L)
C223  value 150p  [CAPC1608X90N]
C224  value 10uF  [CAPC1608X90N]  (hidden comment: GRM188R60G106ME47)
C225  value 100nF  [CAPC1005X06L]  (hidden comment: Cap)
D28  EZAEG2A  [CAPC1005X55N]  (value not drawn)
D29  EZAEG2A  [CAPC1005X55N]  (value not drawn)
J10  SJ1-3533NG  [SJ1-3533NG]
Q32  OPA2342  [SOIC127P600X175-8AN]  (parts A,B,C of 3)
Q34  74LVC2G14  [74LVC2G14-SOP6]
Q35  LD59015C33R  [SOT23-5]
R119  value 10K  [J1-0603]  (hidden comment: RC1608F103CS)
R120  value 24k  [J1-0603]  (hidden comment: RC1608F471CS)
R121  value 24k  [J1-0603]  (hidden comment: RC1608F471CS)
R122  value 10K  [J1-0603]  (hidden comment: RC1608F103CS)
R123  value 7.5k  [J1-0603]  (hidden comment: RC1608F471CS)
R124  value 24k  [J1-0603]  (hidden comment: RC1608F471CS)
R125  value 24k  [J1-0603]  (hidden comment: RC1608F471CS)
R126  value 7.5k  [J1-0603]  (hidden comment: RC1608F471CS)

### Nets
5V: C190.2 Q35.1(VIN) Q35.3(EN)
AUD3V3: C191.2 C224.2 C225.2 Q32.8(V+) Q34.5(VCC) Q35.5(VOUT) R119.1
GND: C190.1 C191.1 C217.2 C220.1 C221.2 C224.1 C225.1 D28.1(A) D29.1(A) J10.1(GND) Q32.4(V-) Q34.2(GND) Q35.2(GND) R122.2
AUDIOBIAS: C220.2 Q32.3(+) Q32.5(+) R119.2 R122.1
LSNDOUT: C218.2 D29.2(K) J10.2(L)
LSOUND: Q34.1(1A)
LSOUNDR: Q34.6(1Y) R120.2
RSNDOUT: C222.2 D28.2(K) J10.3(R)
RSOUND: Q34.3(2A)
RSOUNDR: Q34.4(2Y) R124.2
NetC217_1: C217.1 R120.1 R121.2 R123.2
NetC218_1: C218.1 C219.1 Q32.1 R123.1
NetC219_2: C219.2 Q32.2(-) R121.1
NetC221_1: C221.1 R124.1 R125.2 R126.2
NetC222_1: C222.1 C223.1 Q32.7 R126.1
NetC223_2: C223.2 Q32.6(-) R125.1

Not connected (* = marked no-connect by the designer): Q35 4(BYPASS)

### Library data of the parts
C190 C191 C217-C225 = Cap: Capacitor; Published: 8-Jun-2000; LatestRevisionDate: 17-Jul-2002; LatestRevisionNote: Re-released for DXP Platform.; PackageReference: RAD-0.3; Publisher: Altium Limited; PackageDescription: Radial Cap, Thru-Hole; 2 Leads; 0.3 in Pin Spacing; Supplier 1: Digi-Key
  C190 C224: Supplier Part Number 1: 490-3298-1-ND
  C191 C225: Supplier Part Number 1: 1276-1443-1-ND
  C217 C221: Supplier Part Number 1: PCF1451CT-ND
  C218 C222: Supplier Part Number 1: 718-1920-1-ND
  C219 C223: Supplier Part Number 1: PCF1443CT-ND
  C220: Supplier Part Number 1: 490-5421-1-ND
D28 D29 = D Zener: Zener Diode; Published: 8-Jun-2000; LatestRevisionDate: 17-Jul-2002; LatestRevisionNote: Re-released for DXP Platform.; PackageReference: DIODE-0.7; Publisher: Altium Limited; PackageDescription: Diode, Thru-Hole; 2 Leads; 0.7 in Pin Spacing; Supplier 1: Digi-Key; Supplier Part Number 1: P13571CT-ND
J10 = AUDIO: Supplier 1: Digi-Key; Supplier Part Number 1: CP1-3533NG-ND
Q32 = OPAMP: Supplier 1: Digi-Key; Supplier Part Number 1: OPA2342UA-ND
Q35 = LDO: Supplier 1: Digi-Key; Supplier Part Number 1: 497-10611-1-ND
R119-R126 = Res3: Resistor; Published: 8-Jun-2000; LatestRevisionDate: 29-May-2009; LatestRevisionNote: IPC-7351 Footprint Added.; PackageReference: J1-0603; Publisher: Altium Limited; PackageDescription: Chip Resistor; Supplier 1: Digi-Key
  R119 R122: Supplier Part Number 1: 1276-3485-1-ND
  R120 R121 R124 R125: Supplier Part Number 1: 1276-4777-1-ND
  R123 R126: Supplier Part Number 1: 1276-4732-1-ND
Q34 = 74LVC2G14: Supplier 1: Digi-Key; Supplier Part Number 1: 568-7780-1-ND

## Nets that join several sheets
1V0: power (31 pins), psu (8 pins)
1V5: power (67 pins), mem (C193.1 Q19.1 R84.2), psu (6 pins)
1V8: power (26 pins), conf (7 pins), ethusb (23 pins), gtp (5 pins), psu (6 pins)
2V5: power (9 pins), gtp (C159.1 Q25.5)
3V3: power (32 pins), misc (20 pins), conf (33 pins), ethusb (13 pins), gtp (14 pins), psu (10 pins)
5V: misc (P4.1), mem (C164.2 Q19.6), ethusb (9 pins), psu (27 pins), audio (C190.2 Q35.1 Q35.3)
A1V0: power (5 pins), gtp (7 pins)
A1V2: power (6 pins), gtp (6 pins)
GND: power (204 pins), misc (27 pins), mem (15 pins), conf (58 pins), ethusb (71 pins), gtp (60 pins), psu (54 pins), audio (14 pins)
ETHINT: misc (Q16.9), ethusb (Q10.38)
ETHLED3: misc (Q16.13), ethusb (R132.2)
ETHRESET: misc (D14.1), ethusb (D5.1 Q10.42 R80.2)
ETHRXCLK: conf (Q1.A9), ethusb (R62.1)
ETHRXCTL: conf (Q1.D16), ethusb (R63.1)
ETHRXD0: conf (Q1.E12), ethusb (R64.1)
ETHRXD1: conf (Q1.B16), ethusb (R65.1)
ETHRXD2: conf (Q1.F11), ethusb (R66.1)
ETHRXD3: conf (Q1.A10), ethusb (R67.1)
ETHTXCLK: conf (Q1.D17), ethusb (R56.1)
ETHTXCTL: conf (Q1.F12), ethusb (R57.1)
ETHTXD0: conf (Q1.E14), ethusb (R58.1)
ETHTXD1: conf (Q1.A16), ethusb (R59.1)
ETHTXD2: conf (Q1.E13), ethusb (R60.1)
ETHTXD3: conf (Q1.A15), ethusb (R61.1)
FTRESET: conf (Q6.34), psu (P7.2)
GPIORESET: misc (Q16.16), psu (P7.4)
HOTPLUG: misc (Q1.R2), gtp (D27.2 J7.18)
LSOUND: misc (Q1.A4), audio (Q34.1)
MDIOCK: conf (Q1.D13), ethusb (Q10.36)
MDIOD: conf (Q1.C11), ethusb (Q10.37)
POR: misc (Q16.7), conf (Q1.B18), ethusb (D3.2 D4.2 D5.2), psu (Q29.2 Q29.7 R103.1)
RSOUND: misc (Q1.B4), audio (Q34.3)
USB0CLK: conf (Q1.A14), ethusb (Q8.26)
USB0D0: conf (Q1.C16), ethusb (Q8.3)
USB0D1: conf (Q1.G11), ethusb (Q8.4)
USB0D2: conf (Q1.B11), ethusb (Q8.5)
USB0D3: conf (Q1.F9), ethusb (Q8.6)
USB0D4: conf (Q1.A11), ethusb (Q8.7)
USB0D5: conf (Q1.B9), ethusb (Q8.9)
USB0D6: conf (Q1.F10), ethusb (Q8.10)
USB0D7: conf (Q1.C10), ethusb (Q8.13)
USB0DIR: conf (Q1.E15), ethusb (Q8.31)
USB0NXT: conf (Q1.F14), ethusb (Q8.2)
USB0OC: misc (Q16.14), ethusb (Q12.5)
USB0RESET: misc (D15.1), ethusb (D3.1 Q8.27 R69.2)
USB0STP: conf (Q1.A12), ethusb (Q8.29)
USB1CLK: conf (Q1.D12), ethusb (Q9.26)
USB1D0: conf (Q1.E10), ethusb (Q9.3)
USB1D1: conf (Q1.B14), ethusb (Q9.4)
USB1D2: conf (Q1.D11), ethusb (Q9.5)
USB1D3: conf (Q1.B13), ethusb (Q9.6)
USB1D4: conf (Q1.E9), ethusb (Q9.7)
USB1D5: conf (Q1.C9), ethusb (Q9.9)
USB1D6: conf (Q1.D10), ethusb (Q9.10)
USB1D7: conf (Q1.C13), ethusb (Q9.13)
USB1DIR: conf (Q1.C15), ethusb (Q9.31)
USB1NXT: conf (Q1.B12), ethusb (Q9.2)
USB1OC: misc (Q16.15), ethusb (Q14.5)
USB1RESET: misc (D16.1), ethusb (D4.1 Q9.27 R70.2)
USB1STP: conf (Q1.D15), ethusb (Q9.29)